# Altium schematic sheet Protection Circuit 5V.SchDoc
size A; SheetNumber: 2; SheetTotal: 3
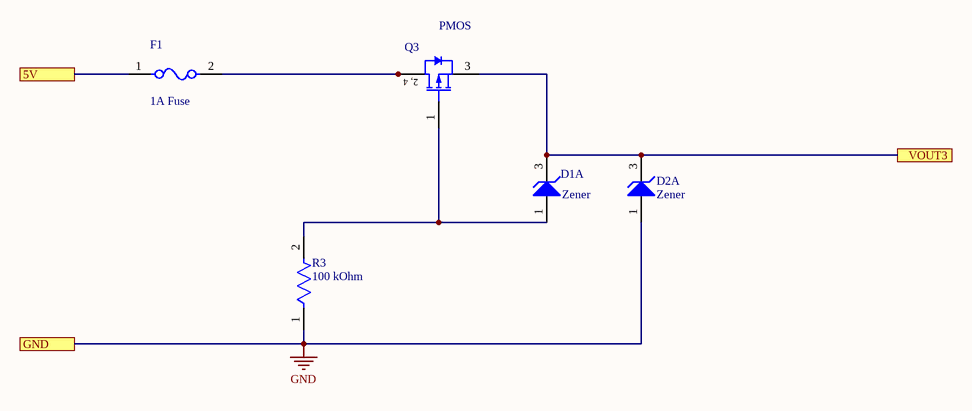
[diagram p0: Protection Circuit 5V.SchDoc]

## Parts
D1  Zener  [ONSC-SOT-23-3-318-08_V]  (part A of 2)
D2  Zener  [ONSC-SOT-23-3-318-08_V]  (part A of 2)
F1  1A Fuse  [FP-0603SFS-MFG]
Q3  PMOS  [FAIR-SOT223-4_V]
R3  100 kOhm  [FP-CR0805-MFG]

## Ports
5V, GND, VOUT3

## Nets
GND: D2.1(A) R3.1 ; port GND
5V: F1.1 ; port 5V
VOUT3: D1.3(K) D2.3(K) Q3.3(SOURCE) ; port VOUT3
NetD1_1: D1.1(A) Q3.1(GATE) R3.2
NetF1_2: F1.2 Q3.2(DRAIN) Q3.4(DRAIN)

## Notes on the sheet
- (in symbol CMP-2000-06838-1) 2, 4

## Library data of the parts
D1 = CMP-1060-01182-1: Zener Voltage Regulator, 225 mW, 3-Pin SOT-23, Pb-Free, Tape and Reel; PartNumber: MMBZ5245BLT3G; Manufacturer: On Semiconductor; VZ Typ (V): 15; ComponentLink3URL: http://www.onsemi.cn/pub_link/Collateral/318-08.PDF; ComponentLink1URL: http://www.onsemi.com/; PackageVersion: Rev. AP, 11/2009; ComponentLink2Description: Datasheet; ComponentLink2URL: http://www.onsemi.cn/pub_link/Collateral/MMBZ5221BLT1-D.PDF; Packing: Tape and Reel; RoHS: Pb-Free; ComponentLink1Description: Manufacturer URL; PackageReference: SOT-23-3-318-08; PackageDescription: 3-Pin Small Outline Transistor, Body 2.92 x 1.3 mm, Pitch 0.95 mm; DatasheetVersion: Rev. 12; Mounting Technology: Surface Mount; ComponentLink3Description: Package Specification
D2 = CMP-1060-01193-1: Zener Voltage Regulator, 225 mW, 3-Pin SOT-23, Pb-Free, Tape and Reel; PartNumber: SZBZX84C39ET1G; Manufacturer: On Semiconductor; PackageVersion: Rev. AP, 11/2009; PackageReference: SOT-23-3-318-08; PackageDescription: 3-Pin Small Outline Transistor, Body 2.92 x 1.3 mm, Pitch 0.95 mm; RoHS: Pb-Free; ComponentLink2Description: Datasheet; Packing: Tape and Reel; ComponentLink3URL: http://www.onsemi.cn/pub_link/Collateral/318-08.PDF; ComponentLink1URL: http://www.onsemi.com/; Mounting Technology: Surface Mount; ComponentLink1Description: Manufacturer URL; ComponentLink3Description: Package Specification; DatasheetVersion: Rev. 8; ComponentLink2URL: http://www.onsemi.com/pub_link/Collateral/BZX84C2V4ET1-D.PDF
F1 = CMP-08605-000034-1: FUSE BOARD MOUNT 1A 32VDC 0603; Manufacturer Part Number: 0603SFS100F/32-2; Manufacturer: Littelfuse; Resistance: 0.2Ω; Fuse Interrupt Dc Current: 50A; Max Fuse Dc Voltage: 32V; Fuse I2T: 0.093A2Sec; Fuse Blow Speed: Slow; Value: 0.2Ω; Device Class L1: Circuit Protection; Device Class L3: unset; Category: Fuse; Temperature Range High: +125°C; ComponentLink2Description: Datasheet; Automotive: No; Device Class L2: Fuses; Lead Free: Yes; Fuse Current: 1A; Temperature: -55°C to +125°C; Digikey Description: FUSE BOARD MOUNT 1A 32VDC 0603; ComponentLink2URL: https://www.littelfuse.com/~/media/electronics/datasheets/fuses/littelfuse_fuse_sfs_datasheet.pdf.pdf; Octopart: https://octopart.com/0603sfs100f%2F32-2-littelfuse-74214378; Voltage Rating: 32V; RoHS: TRUE; Package: 0603SFS; Height: 0.95mm; Ipc Land Pattern Name: CAPC16080X80; Temperature Range Low: -55°C
Q3 = CMP-2000-06838-1: P-Channel Enhancement Mode Field Effect Transistor, 60 V, 2.5 A, -55 to 150 degC, 4-Pin SOT223, RoHS, Tape and Reel; Manufacturer: Fairchild Semiconductor; Drain-Source On Resistance-Max: 300mO; Qg Gate Charge: 15nC; Rated Power Dissipation: 3W; Drain-to-Source Voltage [Vdss]: 60V; Package Version: Rev. 3, 07/2016; Package Reference: SOT223-4; Package URL: https://www.fairchildsemi.com.cn/package-drawings/MA/MA04A.pdf; Datasheet URL: http://www.mouser.com/ds/2/149/NDT2955-116189.pdf; Manufacturer URL: https://www.fairchildsemi.com/; Channel Type: P-Channel; Mounting Technology: SurfaceMount; Package Description: 4-Pin Small Outline Transistor, Body 6.45 x 3.5 mm, Pitch 2.3 mm; Datasheet Version: Rev. 1.4, 04/2015
R3 = CMP-07231-001707-1: Thick Film Chip Resistors 0805 100kΩ 0.125W 5% 200ppm/°C; Power Rating: 125mW; Voltage Rating: 150V; Resistance: 100kR; Case Code (Metric): 2012; Case Code (Imperial): 0805; Temperature Coefficient: 200ppm/°C; Mount: Surface Mount; Tolerance: 5%; Radiation Hardening: No; Military Standard: Not; Contact Plating: Tin; Number of Terminations: 2; Packaging: Tape and Reel; Thickness: 508um; Length: 0.079inch; Depth: 1.25mm; Min Operating Temperature: -55°C; Features: Moisture Resistant; Max Operating Temperature: 155°C; Width: 0.049inch; Package Quantity: 10000; Termination: SMD/SMT; Composition: Thick Film; Max Power Dissipation: 125mW; Height: 0.024inch; Case/Package: 0805